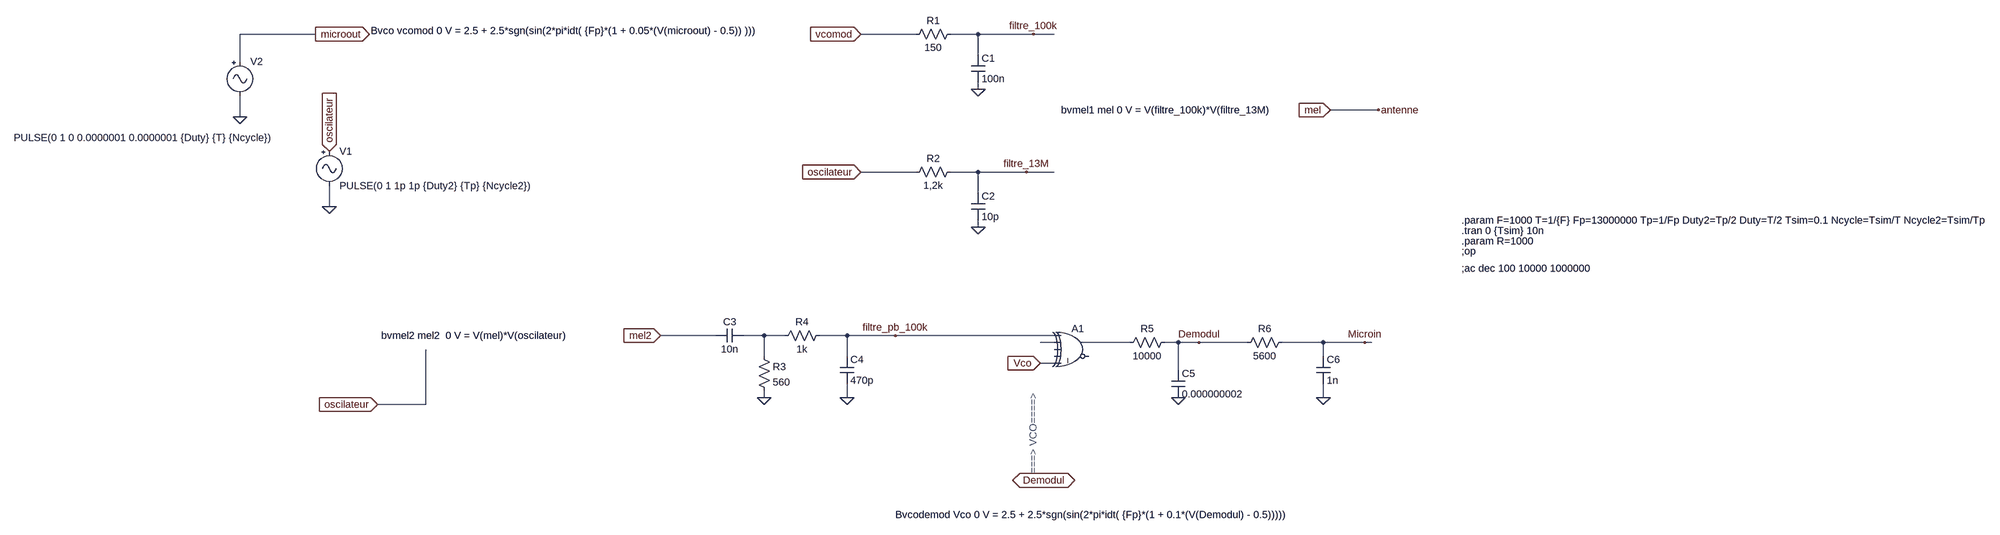
[diagram p0: schematic Draft1.asc]
Draft1.asc, the LTspice schematic file:
Version 4
SHEET 1 4904 1376
WIRE -256 96 -528 96
WIRE 1136 96 1008 96
WIRE 1280 96 1216 96
WIRE 1408 96 1280 96
WIRE 1456 96 1408 96
WIRE 1280 144 1280 96
WIRE -528 160 -528 96
WIRE 1280 224 1280 208
WIRE 2208 272 2096 272
WIRE -528 288 -528 240
WIRE 1136 416 1008 416
WIRE 1280 416 1216 416
WIRE 1392 416 1280 416
WIRE 1456 416 1392 416
WIRE 1280 464 1280 416
WIRE -224 496 -224 448
WIRE 1280 544 1280 528
WIRE 672 944 544 944
WIRE 784 944 736 944
WIRE 832 944 784 944
WIRE 976 944 912 944
WIRE 1088 944 976 944
WIRE 1456 944 1088 944
WIRE 1456 960 1424 960
WIRE 1632 960 1520 960
WIRE 1744 960 1712 960
WIRE 1792 960 1744 960
WIRE 1904 960 1792 960
WIRE 2080 960 1984 960
WIRE 2176 960 2080 960
WIRE 2192 960 2176 960
WIRE 784 992 784 944
WIRE 976 992 976 944
WIRE 2080 992 2080 960
WIRE 1456 1008 1424 1008
WIRE 1744 1024 1744 960
WIRE 784 1088 784 1072
WIRE 976 1088 976 1056
WIRE 2080 1088 2080 1056
WIRE 0 1104 0 976
WIRE 0 1104 -112 1104
FLAG 1008 96 vcomod
IOPIN 1008 96 In
FLAG -256 96 microout
IOPIN -256 96 Out
FLAG 1280 224 0
FLAG 1408 96 filtre_100k
FLAG 1008 416 oscilateur
IOPIN 1008 416 In
FLAG 1280 544 0
FLAG 1392 416 filtre_13M
FLAG 2096 272 mel
IOPIN 2096 272 In
FLAG 2208 272 antenne
FLAG -112 1104 oscilateur
IOPIN -112 1104 In
FLAG 544 944 mel2
IOPIN 544 944 In
FLAG 784 1088 0
FLAG 976 1088 0
FLAG 1088 944 filtre_pb_100k
FLAG 1792 960 Demodul
FLAG 1424 1008 Vco
IOPIN 1424 1008 In
FLAG 1744 1088 0
FLAG 1360 1280 Demodul
IOPIN 1360 1280 BiDir
FLAG 2080 1088 0
FLAG 2176 960 Microin
FLAG -224 496 0
FLAG -224 368 oscilateur
IOPIN -224 368 In
FLAG -528 288 0
SYMBOL res 1232 80 R90
WINDOW 0 0 56 VBottom 2
WINDOW 3 32 56 VTop 2
SYMATTR InstName R1
SYMATTR Value 150
SYMBOL cap 1264 144 R0
SYMATTR InstName C1
SYMATTR Value 100n
SYMBOL res 1232 400 R90
WINDOW 0 0 56 VBottom 2
WINDOW 3 32 56 VTop 2
SYMATTR InstName R2
SYMATTR Value 1,2k
SYMBOL cap 1264 464 R0
SYMATTR InstName C2
SYMATTR Value 10p
SYMBOL cap 736 928 R90
WINDOW 0 0 32 VBottom 2
WINDOW 3 32 32 VTop 2
SYMATTR InstName C3
SYMATTR Value 10n
SYMBOL res 768 976 R0
SYMATTR InstName R3
SYMATTR Value 560
SYMBOL res 928 928 R90
WINDOW 0 0 56 VBottom 2
WINDOW 3 32 56 VTop 2
SYMATTR InstName R4
SYMATTR Value 1k
SYMBOL cap 960 992 R0
SYMATTR InstName C4
SYMATTR Value 470p
SYMBOL Digital\\xor 1504 912 R0
SYMATTR InstName A1
SYMBOL res 1728 944 R90
WINDOW 0 0 56 VBottom 2
WINDOW 3 32 56 VTop 2
SYMATTR InstName R5
SYMATTR Value 10000
SYMBOL cap 1728 1024 R0
SYMATTR InstName C5
SYMATTR Value 0.000000002
SYMBOL cap 2064 992 R0
SYMATTR InstName C6
SYMATTR Value 1n
SYMBOL res 2000 944 R90
WINDOW 0 0 56 VBottom 2
WINDOW 3 32 56 VTop 2
SYMATTR InstName R6
SYMATTR Value 5600
SYMBOL Misc\\signal -224 352 R0
WINDOW 123 0 0 Left 0
WINDOW 39 0 0 Left 0
SYMATTR InstName V1
SYMATTR Value PULSE(0 1 1p 1p {Duty2} {Tp} {Ncycle2})
SYMBOL Misc\\signal -528 144 R0
WINDOW 3 -524 192 Left 2
SYMATTR Value PULSE(0 1 0 0.0000001 0.0000001 {Duty} {T} {Ncycle})
SYMATTR InstName V2
TEXT -128 88 Left 2 !Bvco vcomod 0 V = 2.5 + 2.5*sgn(sin(2*pi*idt( {Fp}*(1 + 0.05*(V(microout) - 0.5)) )))
TEXT 1472 272 Left 2 !bvmel1 mel 0 V = V(filtre_100k)*V(filtre_13M)
TEXT -104 944 Left 2 !bvmel2 mel2  0 V = V(mel)*V(oscilateur)
TEXT 1408 1264 VLeft 2 ;===> VCO====>
TEXT 1088 1360 Left 2 !Bvcodemod Vco 0 V = 2.5 + 2.5*sgn(sin(2*pi*idt( {Fp}*(1 + 0.1*(V(Demodul) - 0.5)))))
TEXT 3504 576 Left 2 !.param R=1000
TEXT 3504 600 Left 2 !;op
TEXT 3504 552 Left 2 !.tran 0 {Tsim} 10n
TEXT 3504 528 Left 2 !.param F=1000 T=1/{F} Fp=13000000 Tp=1/Fp Duty2=Tp/2 Duty=T/2 Tsim=0.1 Ncycle=Tsim/T Ncycle2=Tsim/Tp
TEXT 3504 640 Left 2 !;ac dec 100 10000 1000000

The netlist it stands for:
* Draft1.asc
R1 filtre_100k vcomod 150
C1 filtre_100k 0 100n
R2 filtre_13M oscilateur 1,2k
C2 filtre_13M 0 10p
C3 N001 mel2 10n
R3 N001 0 560
R4 filtre_pb_100k N001 1k
C4 filtre_pb_100k 0 470p
A1 filtre_pb_100k N002 0 0 Vco 0 N003 0 XOR
R5 Demodul N003 10000
C5 Demodul 0 0.000000002
C6 Microin 0 1n
R6 Microin Demodul 5600
V1 oscilateur 0 PULSE(0 1 1p 1p {Duty2} {Tp} {Ncycle2})
V2 microout 0 PULSE(0 1 0 0.0000001 0.0000001 {Duty} {T} {Ncycle})
Bvco vcomod 0 V = 2.5 + 2.5*sgn(sin(2*pi*idt( {Fp}*(1 + 0.05*(V(microout) - 0.5)) )))
bvmel1 mel 0 V = V(filtre_100k)*V(filtre_13M)
bvmel2 mel2  0 V = V(mel)*V(oscilateur)
* ===> VCO====>
Bvcodemod Vco 0 V = 2.5 + 2.5*sgn(sin(2*pi*idt( {Fp}*(1 + 0.1*(V(Demodul) - 0.5)))))
.param R=1000
;op
.tran 0 {Tsim} 10n
.param F=1000 T=1/{F} Fp=13000000 Tp=1/Fp Duty2=Tp/2 Duty=T/2 Tsim=0.1 Ncycle=Tsim/T Ncycle2=Tsim/Tp
;ac dec 100 10000 1000000
.backanno
.end